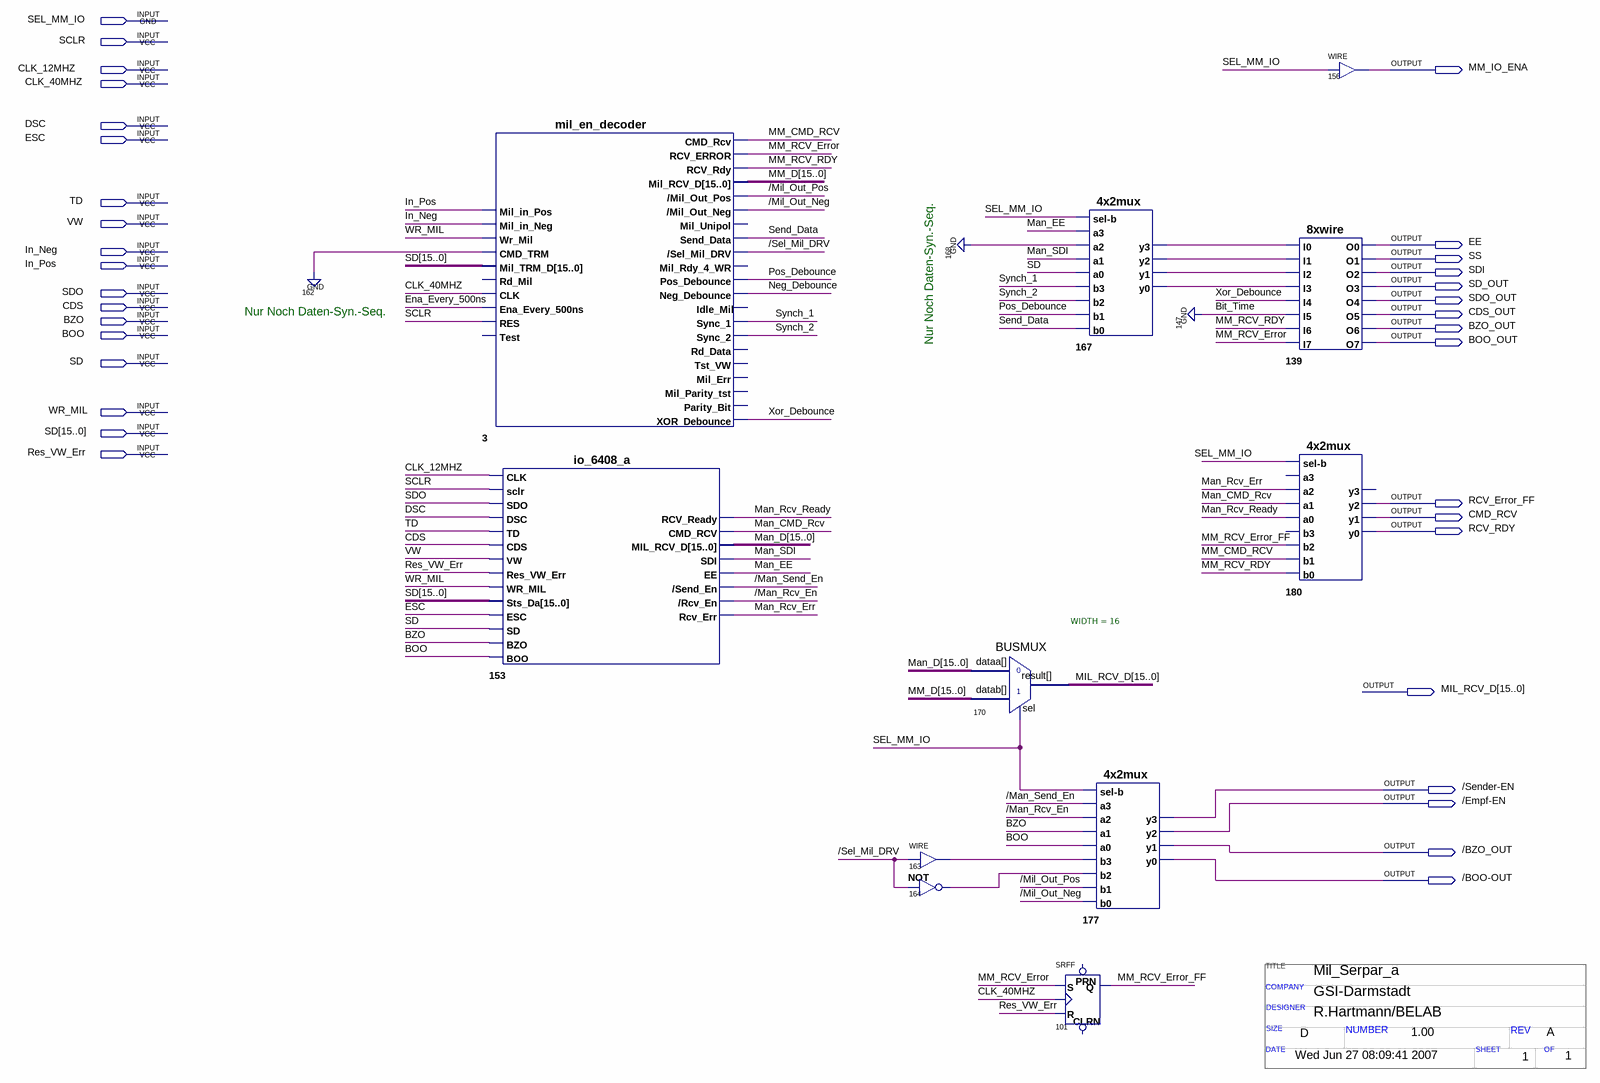
[diagram p0: schematic sheet]
// Quartus schematic mil_serpar_a.bdf as structural Verilog: 11 symbols, 35 pins
// Title block: TITLE: Mil_Serpar_a; COMPANY: GSI-Darmstadt; DESIGNER: R.Hartmann/BELAB; SIZE: D; NUMBER: 1.00; REV: A; DATE: Wed Jun 27 08:09:41 2007; SHEET: 1; OF: 1
module mil_serpar_a (
  input  SEL_MM_IO,
  input  SCLR,
  input  CLK_12MHZ,
  input  CLK_40MHZ,
  input  DSC,
  input  ESC,
  input  TD,
  input  VW,
  input  In_Neg,
  input  In_Pos,
  input  SDO,
  input  CDS,
  input  BZO,
  input  BOO,
  input  SD_1bit,
  input  WR_MIL,
  input  [15:0] SD,
  input  Res_VW_Err,
  output MM_IO_ENA,
  output EE,
  output SS,
  output SDI,
  output SD_OUT,
  output SDO_OUT,
  output CDS_OUT,
  output BZO_OUT,
  output BOO_OUT,
  output RCV_Error_FF,
  output CMD_RCV,
  output RCV_RDY,
  output [15:0] MIL_RCV_D,
  output \/Sender-EN ,
  output \/Empf-EN ,
  output \/BZO_OUT ,
  output \/BOO-OUT 
);

  wire \/Man_Rcv_En , \/Man_Send_En , \/Mil_Out_Neg , \/Mil_Out_Pos , \/Sel_Mil_DRV , Ena_Every_500ns,
       Man_CMD_Rcv, Man_EE, Man_Rcv_Err, Man_Rcv_Ready, Man_SDI, MM_CMD_RCV, MM_RCV_Error, MM_RCV_Error_FF,
       MM_RCV_RDY, n163_out, n164_out, n167_y0, n167_y1, n167_y2, n167_y3, Neg_Debounce, Pos_Debounce,
       Send_Data, Synch_1, Synch_2, Xor_Debounce;
  wire [15:0] Man_D, MM_D;

  mil_en_decoder u_3 (
    .Mil_in_Pos(In_Pos), .Mil_in_Neg(In_Neg), .Wr_Mil(WR_MIL), .CMD_TRM(1'b0), .Mil_TRM_D(SD),
    .CLK(CLK_40MHZ), .Ena_Every_500ns(Ena_Every_500ns), .RES(SCLR), .CMD_Rcv(MM_CMD_RCV),
    .RCV_ERROR(MM_RCV_Error), .RCV_Rdy(MM_RCV_RDY), .Mil_RCV_D(MM_D), .\/Mil_Out_Pos (\/Mil_Out_Pos ),
    .\/Mil_Out_Neg (\/Mil_Out_Neg ), .Send_Data(Send_Data), .\/Sel_Mil_DRV (\/Sel_Mil_DRV ),
    .Pos_Debounce(Pos_Debounce), .Neg_Debounce(Neg_Debounce), .Sync_1(Synch_1), .Sync_2(Synch_2),
    .XOR_Debounce(Xor_Debounce));  // open: Rd_Mil, Test, Mil_Unipol, Mil_Rdy_4_WR, Idle_Mil, Rd_Data, Tst_VW, Mil_Err, Mil_Parity_tst, Parity_Bit
  io_6408_a u_153 (
    .CLK(CLK_12MHZ), .sclr(SCLR), .SDO(SDO), .DSC(DSC), .TD(TD), .CDS(CDS), .VW(VW), .Res_VW_Err(Res_VW_Err),
    .WR_MIL(WR_MIL), .Sts_Da(SD), .ESC(ESC), .SD(SD_1bit), .BZO(BZO), .BOO(BOO), .RCV_Ready(Man_Rcv_Ready),
    .CMD_RCV(Man_CMD_Rcv), .MIL_RCV_D(Man_D), .SDI(Man_SDI), .EE(Man_EE), .\/Send_En (\/Man_Send_En ),
    .\/Rcv_En (\/Man_Rcv_En ), .Rcv_Err(Man_Rcv_Err));
  assign n163_out = \/Sel_Mil_DRV ;  // WIRE 163
  not u_164 (n164_out, \/Sel_Mil_DRV );
  BUSMUX #(.WIDTH(16)) u_170 (.datab(MM_D), .sel(SEL_MM_IO), .dataa(Man_D), .result(MIL_RCV_D));
  SRFF u_101 (.S(MM_RCV_Error), .R(Res_VW_Err), .CLK(CLK_40MHZ), .Q(MM_RCV_Error_FF));  // open: PRN, CLRN
  \4x2mux  u_167 (
    .\sel-b (SEL_MM_IO), .a3(Man_EE), .a2(1'b0), .a1(Man_SDI), .a0(SD_1bit), .b3(Synch_1), .b2(Synch_2),
    .b1(Pos_Debounce), .b0(Send_Data), .y3(n167_y3), .y2(n167_y2), .y1(n167_y1), .y0(n167_y0));
  \4x2mux  u_177 (
    .\sel-b (SEL_MM_IO), .a3(\/Man_Send_En ), .a2(\/Man_Rcv_En ), .a1(BZO), .a0(BOO), .b3(n163_out),
    .b2(n164_out), .b1(\/Mil_Out_Pos ), .b0(\/Mil_Out_Neg ), .y3(\/Sender-EN ), .y2(\/Empf-EN ),
    .y1(\/BZO_OUT ), .y0(\/BOO-OUT ));
  \8xwire  u_139 (
    .I0(n167_y3), .I1(n167_y2), .I2(n167_y1), .I3(n167_y0), .I4(Xor_Debounce), .I5(1'b0), .I6(MM_RCV_RDY),
    .I7(MM_RCV_Error), .O0(EE), .O1(SS), .O2(SDI), .O3(SD_OUT), .O4(SDO_OUT), .O5(CDS_OUT), .O6(BZO_OUT),
    .O7(BOO_OUT));
  \4x2mux  u_180 (
    .\sel-b (SEL_MM_IO), .a2(Man_Rcv_Err), .a1(Man_CMD_Rcv), .a0(Man_Rcv_Ready), .b2(MM_RCV_Error_FF),
    .b1(MM_CMD_RCV), .b0(MM_RCV_RDY), .y2(RCV_Error_FF), .y1(CMD_RCV), .y0(RCV_RDY));  // open: a3, b3, y3
  assign MM_IO_ENA = SEL_MM_IO;  // WIRE 156

  // Notes on the sheet:
  //   Nur Noch Daten-Syn.-Seq.
  //   Nur Noch Daten-Syn.-Seq.
endmodule
